# EasyEDA schematic [Schematic EasyEDA] - openELECTRO - ARDUINO NANO SHIELD v1.02.json
TITLE: openELECTRO - ArduinoNANO SHIELD - oven; REV: 1.02; Date: 2022-06-24; Sheet: 1/1; Drawn By: CaRLyMx; Company: carlymx@gmail.com
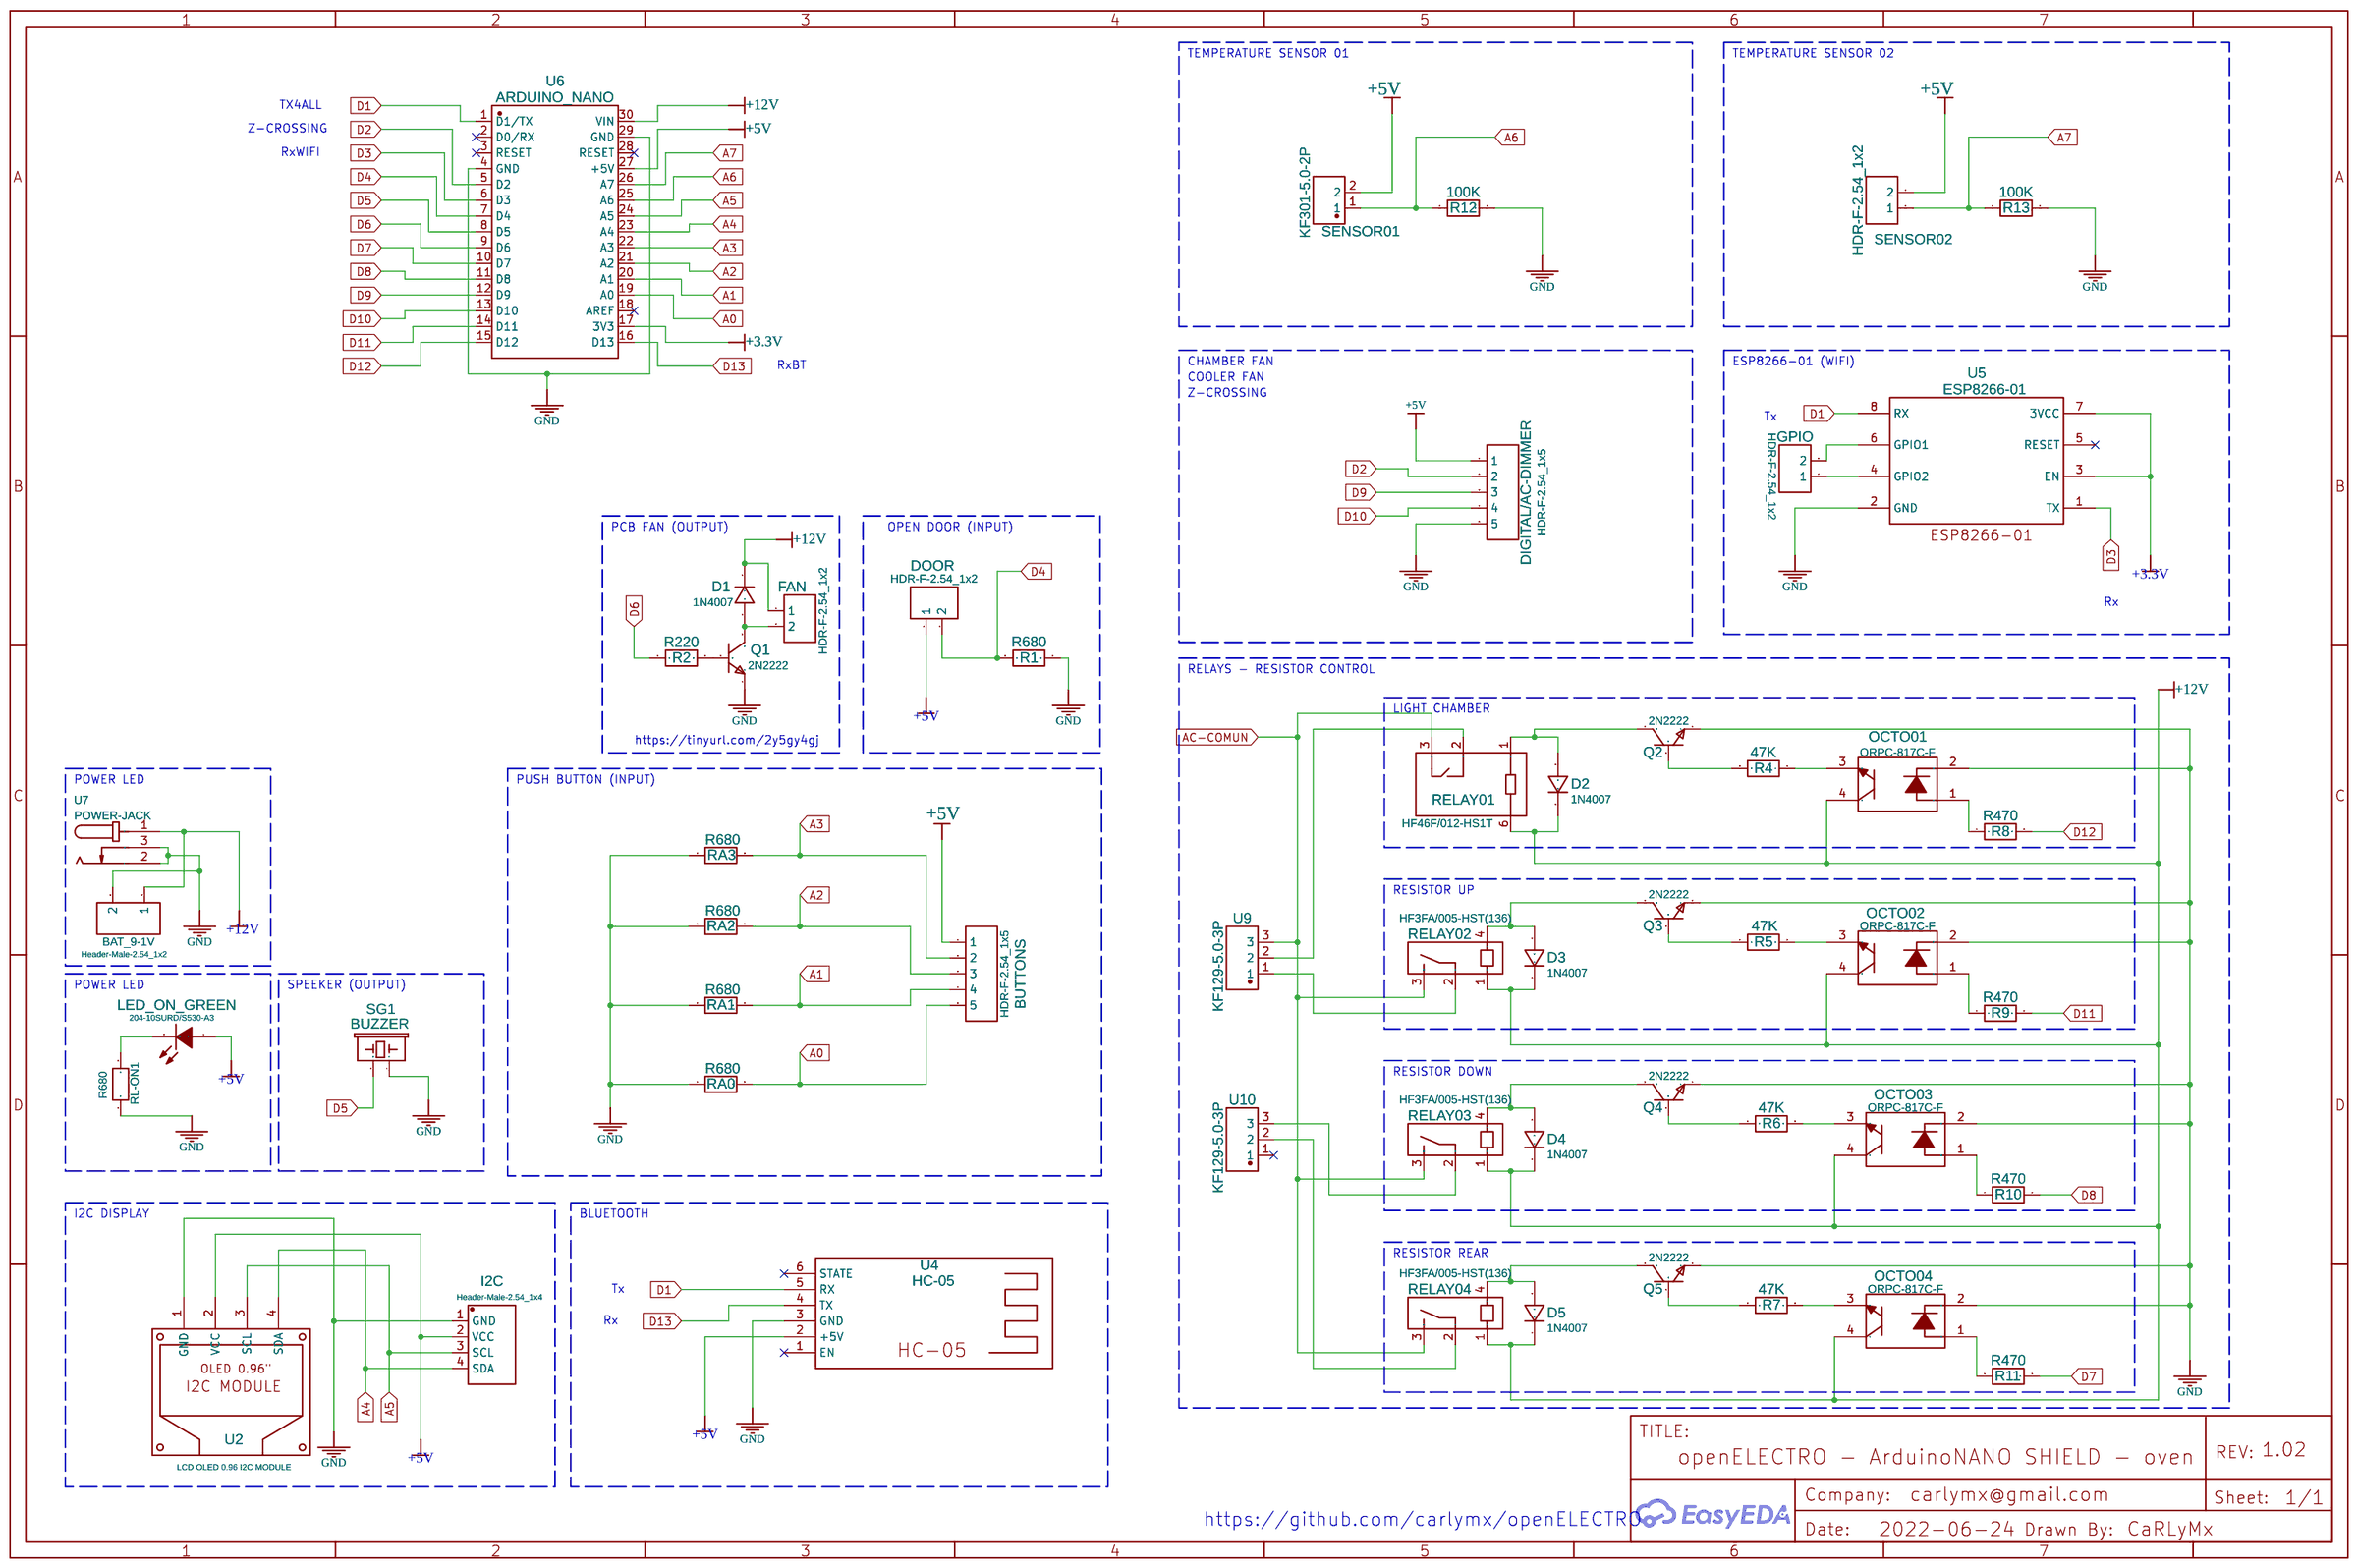
[diagram p0: schematic sheet]

## Parts
BAT_9-1V  Header-Male-2.54_1x2  [HDR-2X1/2.54]
BUTTONS  HDR-F-2.54_1x5  [HDR-F-2.54_1X5]
D1  1N4007  [DO-41_BD2.4-L4.7-P8.70-D0.6-RD]
D2  1N4007  [DO-41_BD2.4-L4.7-P8.70-D0.9-RD]
D3  1N4007  [DO-41_BD2.4-L4.7-P8.70-D0.9-RD]
D4  1N4007  [DO-41_BD2.4-L4.7-P8.70-D0.9-RD]
D5  1N4007  [DO-41_BD2.4-L4.7-P8.70-D0.9-RD]
DIGITAL/AC-DIMMER  HDR-F-2.54_1x5  [HDR-F-2.54_1X5]
DOOR  HDR-F-2.54_1x2  [HDR-F-2.54_1X2]
FAN  HDR-F-2.54_1x2  [HDR-F-2.54_1X2]
GPIO  HDR-F-2.54_1x2  [HDR-F-2.54_1X2]
I2C  Header-Male-2.54_1x4  [DIP-1X4P-2.54MM-M]
LED_ON_GREEN  204-10SURD/S530-A3  [LED-3MM/2.54]
OCTO01  ORPC-817C-F  [DIP-4_L4.6-W6.5-P2.54-LS7.6-BR]
OCTO02  ORPC-817C-F  [DIP-4_L4.6-W6.5-P2.54-LS7.6-BR]
OCTO03  ORPC-817C-F  [DIP-4_L4.6-W6.5-P2.54-LS7.6-BR]
OCTO04  ORPC-817C-F  [DIP-4_L4.6-W6.5-P2.54-LS7.6-BR]
Q1  2N2222  [TO-92-3_L4.9-W3.7-P1.27-L]
Q2  2N2222  [TO-92-3_L4.9-W3.7-P1.27-L]
Q3  2N2222  [TO-92-3_L4.9-W3.7-P1.27-L]
Q4  2N2222  [TO-92-3_L4.9-W3.7-P1.27-L]
Q5  2N2222  [TO-92-3_L4.9-W3.7-P1.27-L]
R1  R680  [R_AXIAL-0.3]
R2  R220  [R_AXIAL-0.3]
R4  47K  [R_AXIAL-0.3]
R5  47K  [R_AXIAL-0.3]
R6  47K  [R_AXIAL-0.3]
R7  47K  [R_AXIAL-0.3]
R8  R470  [R_AXIAL-0.3]
R9  R470  [R_AXIAL-0.3]
R10  R470  [R_AXIAL-0.3]
R11  R470  [R_AXIAL-0.3]
R12  100K  [R_AXIAL-0.3]
R13  100K  [R_AXIAL-0.3]
RA0  R680  [R_AXIAL-0.3]
RA1  R680  [R_AXIAL-0.3]
RA2  R680  [R_AXIAL-0.3]
RA3  R680  [R_AXIAL-0.3]
RELAY01  HF46F/012-HS1T  [RELAYS-TH_HF46F-XX-HS1-XXX]
RELAY02  HF3FA/005-HST(136)  [RELAY-TH_HF3FA-005-HST-136]
RELAY03  HF3FA/005-HST(136)  [RELAY-TH_HF3FA-005-HST-136]
RELAY04  HF3FA/005-HST(136)  [RELAY-TH_HF3FA-005-HST-136]
RL-ON1  R680  [AXIAL-0.3]
SENSOR01  KF301-5.0-2P  [CONN-TH_P5.00_KF301-5.0-2P]
SENSOR02  HDR-F-2.54_1x2  [HDR-F-2.54_1X2]
SG1  BUZZER  [BUZZER-12MM-NS-KIT]
U2  LCD OLED 0.96 I2C MODULE  [HDR-F-2.54_1X4]
U4  HC-05  [HDR-F-2.54_1X6]
U5  ESP8266-01  [HDR-F-2.54_2X4]
U6  ARDUINO_NANO  [COMM-TH_ARDUINO_NANO]
U7  POWER-JACK  [DC-IN-TH_POWER-JACK]
U9  KF129-5.0-3P  [CONN-TH_3P-P5.00_KF129-5.0-3P]
U10  KF129-5.0-3P  [CONN-TH_3P-P5.00_KF129-5.0-3P]

## Library data of the parts
BAT_9-1V = -: Supplier: LCSC; Manufacturer: TE Connectivity; Manufacturer Part: 826629-2; image: //image.lceda.cn/szlcsc/C86471.jpg; Supplier Part: C86471
BUTTONS DIGITAL/AC-DIMMER = HDR-F-2.54_1x5: Supplier Part: C50950; Supplier: LCSC; Contributor: LCEDA_Lib
D1-D5 = 1N4007: Supplier: LCSC; Manufacturer: SEMTECH; Supplier Part: C106903; Contributor: LCEDA_Lib
DOOR FAN GPIO SENSOR02 = HDR-F-2.54_1x2: Supplier Part: C49661; Supplier: LCSC; Contributor: LCEDA_Lib
I2C = -: Supplier: LCSC; Manufacturer: Ckmtw; Manufacturer Part: 210S-1*4P L=11.6MMGold-plated black; Contributor: LCSC; Supplier Part: C124378
LED_ON_GREEN = -: Supplier: LCSC; Manufacturer: EVERLIGHT; Supplier Part: C99772
OCTO01 OCTO02 OCTO03 OCTO04 = ORPC-817C-F: Supplier: LCSC; Supplier Part: C2842770; Manufacturer: Orient(奥伦德); Contributor: LCSC
Q1-Q5 = 2N2222: Supplier: LCSC; Manufacturer: SEMTECH; Contributor: LCSC; Supplier Part: C118536; JLCPCB Part Class: Extended Part
R1 R2 R4-R13 = R_0603_EU: Contributor: LCEDA_Lib
RA0-RA3 RL-ON1 = Res_AXIAL-0.3(1/8W)_EU
RELAY01 = HF46F/012-HS1T: Supplier: LCSC; Supplier Part: C2976852; Manufacturer: HF(宏发); link: https://atta.szlcsc.com/upload/public/pdf/source/20220224/4471DAC9234B5C2A1A34433FC9A7C12C.pdf; Contributor: LCSC
RELAY02 RELAY03 RELAY04 = HF3FA/005-HST(136): Supplier: LCSC; Supplier Part: C712707; Manufacturer: HF(Xiamen Hongfa Electroacoustic); Contributor: LCSC; JLCPCB Part Class: Extended Part
SENSOR01 = KF301-5.0-2P: Supplier: LCSC; Supplier Part: C474881; Manufacturer: Cixi Kefa Elec; Contributor: LCSC; JLCPCB Part Class: Extended Part
SG1 = -: Contributor: SparkFun
U2 = -: Manufacturer Part: Control Chip SSD1306; link: http://www.inno-maker.com/wp-content/uploads/2019/03/096-OLED-Module-User-Manual-v1000-en.pdf; Contributor: carlymx
U4 = -: Supplier: MR; Contributor: SRY TIS
U5 = ESP8266-01: Supplier: LCSC; Contributor: Dan3D_Concept
U6 = ARDUINO_NANO: Supplier: LCSC; Supplier Part: C9900017879; Manufacturer: null; JLCPCB Part Class: Extended Part; Contributor: lcsc
U7 = POWER-JACK: Supplier: LCSC; Supplier Part: C9900001795; Manufacturer: null; JLCPCB Part Class: Extended Part; Contributor: LCSC
U9 U10 = KF129-5.0-3P: Supplier: LCSC; Supplier Part: C475091; Manufacturer: Cixi Kefa Elec; Contributor: LCSC; JLCPCB Part Class: Extended Part

## Nets
+3.3V: U5.3(EN) U5.7(3VCC) U6.17(3V3)
+5V: BUTTONS.1 DIGITAL/AC-DIMMER.1 DOOR.1 I2C.2(VCC) LED_ON_GREEN.1(A) SENSOR01.2 SENSOR02.2 U2.2(VCC) U4.2(+5V) U6.27(+5V)
+12V: BAT_9-1V.1 D1.1 D2.1 D3.1 D4.1 D5.1 FAN.1 OCTO01.4 OCTO02.4 OCTO03.4 OCTO04.4 RELAY01.6 RELAY02.1 RELAY03.1 RELAY04.1 U6.30(VIN) U7.1
GND: BAT_9-1V.2 DIGITAL/AC-DIMMER.5 I2C.1(GND) OCTO01.2 OCTO02.2 OCTO03.2 OCTO04.2 Q1.1(E) Q2.1(E) Q3.1(E) Q4.1(E) Q5.1(E) R1.1 R12.2 R13.2 RA0.1 RA1.1 RA2.1 RA3.1 RL-ON1.1 SG1.-(2) U2.1(GND) U4.3(GND) U5.2(GND) U6.4(GND) U6.29(GND) U7.2 U7.3
A0: BUTTONS.5 RA0.2 U6.19(A0)
A1: BUTTONS.4 RA1.2 U6.20(A1)
A2: BUTTONS.3 RA2.2 U6.21(A2)
A3: BUTTONS.2 RA3.2 U6.22(A3)
A4: I2C.4(SDA) U2.4(SDA) U6.23(A4)
A5: I2C.3(SCL) U2.3(SCL) U6.24(A5)
A6: R12.1 SENSOR01.1 U6.25(A6)
A7: R13.1 SENSOR02.1 U6.26(A7)
AC-COMUN: RELAY01.3 RELAY02.3 RELAY03.3 RELAY04.3 U9.3
D1: U4.5(RX) U5.8(RX) U6.1(D1/TX)
D2: DIGITAL/AC-DIMMER.2 U6.5(D2)
D3: U5.1(TX) U6.6(D3)
D4: DOOR.2 R1.2 U6.7(D4)
D5: SG1.+(1) U6.8(D5)
D6: R2.1 U6.9(D6)
D7: R11.2 U6.10(D7)
D8: R10.2 U6.11(D8)
D9: DIGITAL/AC-DIMMER.3 U6.12(D9)
D10: DIGITAL/AC-DIMMER.4 U6.13(D10)
D11: R9.2 U6.14(D11)
D12: R8.2 U6.15(D12)
D13: U4.4(TX) U6.16(D13)
Net-(D1-2): D1.2 FAN.2 Q1.3(C)
Net-(D2-2): D2.2 Q2.3(C) RELAY01.1
Net-(D3-2): D3.2 Q3.3(C) RELAY02.4
Net-(D4-2): D4.2 Q4.3(C) RELAY03.4
Net-(D5-2): D5.2 Q5.3(C) RELAY04.4
Net-(GPIO-1): GPIO.1 U5.4(GPIO2)
Net-(GPIO-2): GPIO.2 U5.6(GPIO1)
Net-(LED_ON_GREEN-2): LED_ON_GREEN.2(K) RL-ON1.2
Net-(OCTO01-1): OCTO01.1 R8.1
Net-(OCTO01-3): OCTO01.3 R4.1
Net-(OCTO02-1): OCTO02.1 R9.1
Net-(OCTO02-3): OCTO02.3 R5.2
Net-(OCTO03-1): OCTO03.1 R10.1
Net-(OCTO03-3): OCTO03.3 R6.2
Net-(OCTO04-1): OCTO04.1 R11.1
Net-(OCTO04-3): OCTO04.3 R7.2
Net-(Q1-2): Q1.2(B) R2.2
Net-(Q2-2): Q2.2(B) R4.2
Net-(Q3-2): Q3.2(B) R5.1
Net-(Q4-2): Q4.2(B) R6.1
Net-(Q5-2): Q5.2(B) R7.1
Net-(RELAY01-2): RELAY01.2 U9.2
Net-(RELAY02-2): RELAY02.2 U9.1
Net-(RELAY03-2): RELAY03.2 U10.3
Net-(RELAY04-2): RELAY04.2 U10.2

Not connected (* = marked no-connect by the designer): U4 1(EN)* 6(STATE)*; U5 5(RESET)*; U6 2(D0/RX)* 3(RESET)* 18(AREF)* 28(RESET)*; U10 1*

## Notes on the sheet
- TEMPERATURE SENSOR 01
- TEMPERATURE SENSOR 02
- TX4ALL
- Z-CROSSING
- RxWIFI
- RxBT
- CHAMBER FAN
- COOLER FAN
- ESP8266-01 (WIFI)
- Z-CROSSING
- Tx
- PCB FAN (OUTPUT)
- OPEN DOOR (INPUT)
- Rx
- RELAYS - RESISTOR CONTROL
- LIGHT CHAMBER
- https://tinyurl.com/2y5gy4gj
- POWER LED
- PUSH BUTTON (INPUT)
- RESISTOR UP
- POWER LED
- SPEEKER (OUTPUT)
- RESISTOR DOWN
- I2C DISPLAY
- BLUETOOTH
- RESISTOR REAR
- Tx
- Rx
- https://github.com/carlymx/openELECTRO
